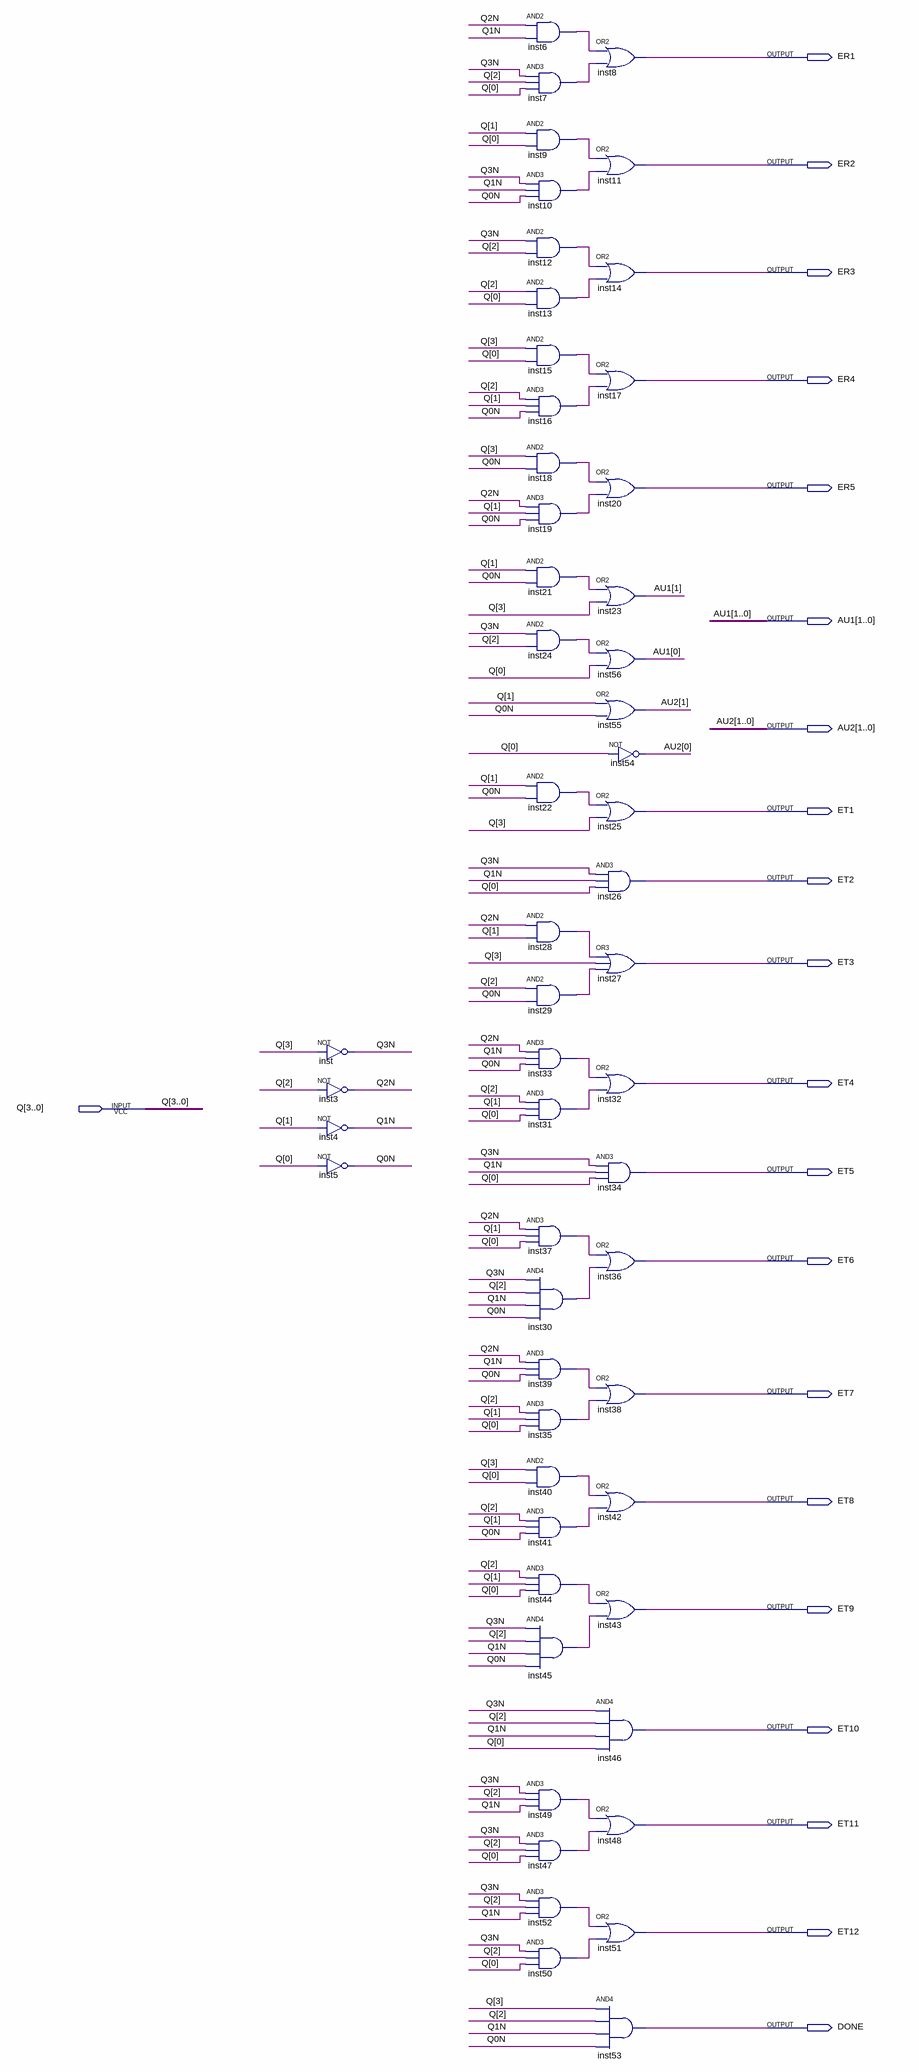
[diagram p0: schematic sheet]
// Quartus schematic OUTPUT.bdf as structural Verilog: 55 symbols, 21 pins
module OUTPUT (
  input  [3:0] Q,
  output ER1,
  output ER2,
  output ER3,
  output ER4,
  output ER5,
  output [1:0] AU1,
  output [1:0] AU2,
  output ET1,
  output ET2,
  output ET3,
  output ET4,
  output ET5,
  output ET6,
  output ET7,
  output ET8,
  output ET9,
  output ET10,
  output ET11,
  output ET12,
  output DONE
);

  wire inst6_out, inst7_out, inst9_out, inst10_out, inst12_out, inst13_out, inst15_out, inst16_out,
       inst18_out, inst19_out, inst21_out, inst22_out, inst24_out, inst28_out, inst29_out, inst30_out,
       inst31_out, inst33_out, inst35_out, inst37_out, inst39_out, inst40_out, inst41_out, inst44_out,
       inst45_out, inst47_out, inst49_out, inst50_out, inst52_out, Q0N, Q1N, Q2N, Q3N;

  not inst (Q3N, Q[3]);
  not inst3 (Q2N, Q[2]);
  not inst4 (Q1N, Q[1]);
  not inst5 (Q0N, Q[0]);
  and inst6 (inst6_out, Q2N, Q1N);
  and inst7 (inst7_out, Q3N, Q[2], Q[0]);
  and inst9 (inst9_out, Q[1], Q[0]);
  and inst10 (inst10_out, Q3N, Q1N, Q0N);
  and inst12 (inst12_out, Q3N, Q[2]);
  and inst13 (inst13_out, Q[2], Q[0]);
  and inst15 (inst15_out, Q[3], Q[0]);
  and inst16 (inst16_out, Q[2], Q[1], Q0N);
  and inst18 (inst18_out, Q[3], Q0N);
  and inst19 (inst19_out, Q2N, Q[1], Q0N);
  and inst21 (inst21_out, Q[1], Q0N);
  and inst24 (inst24_out, Q3N, Q[2]);
  and inst22 (inst22_out, Q[1], Q0N);
  and inst28 (inst28_out, Q2N, Q[1]);
  and inst29 (inst29_out, Q[2], Q0N);
  and inst33 (inst33_out, Q2N, Q1N, Q0N);
  and inst31 (inst31_out, Q[2], Q[1], Q[0]);
  and inst37 (inst37_out, Q2N, Q[1], Q[0]);
  and inst30 (inst30_out, Q3N, Q[2], Q1N, Q0N);
  and inst39 (inst39_out, Q2N, Q1N, Q0N);
  and inst35 (inst35_out, Q[2], Q[1], Q[0]);
  and inst40 (inst40_out, Q[3], Q[0]);
  and inst41 (inst41_out, Q[2], Q[1], Q0N);
  and inst44 (inst44_out, Q[2], Q[1], Q[0]);
  and inst45 (inst45_out, Q3N, Q[2], Q1N, Q0N);
  and inst49 (inst49_out, Q3N, Q[2], Q1N);
  and inst47 (inst47_out, Q3N, Q[2], Q[0]);
  and inst52 (inst52_out, Q3N, Q[2], Q1N);
  and inst50 (inst50_out, Q3N, Q[2], Q[0]);
  or inst8 (ER1, inst6_out, inst7_out);
  or inst11 (ER2, inst9_out, inst10_out);
  or inst14 (ER3, inst12_out, inst13_out);
  or inst17 (ER4, inst15_out, inst16_out);
  or inst20 (ER5, inst18_out, inst19_out);
  or inst23 (AU1[1], inst21_out, Q[3]);
  or inst56 (AU1[0], inst24_out, Q[0]);
  or inst55 (AU2[1], Q[1], Q0N);
  not inst54 (AU2[0], Q[0]);
  or inst25 (ET1, inst22_out, Q[3]);
  and inst26 (ET2, Q3N, Q1N, Q[0]);
  or inst27 (ET3, inst28_out, Q[3], inst29_out);
  or inst32 (ET4, inst33_out, inst31_out);
  and inst34 (ET5, Q3N, Q1N, Q[0]);
  or inst36 (ET6, inst37_out, inst30_out);
  or inst38 (ET7, inst39_out, inst35_out);
  or inst42 (ET8, inst40_out, inst41_out);
  or inst43 (ET9, inst44_out, inst45_out);
  and inst46 (ET10, Q3N, Q[2], Q1N, Q[0]);
  or inst48 (ET11, inst49_out, inst47_out);
  or inst51 (ET12, inst52_out, inst50_out);
  and inst53 (DONE, Q[3], Q[2], Q1N, Q0N);
endmodule
